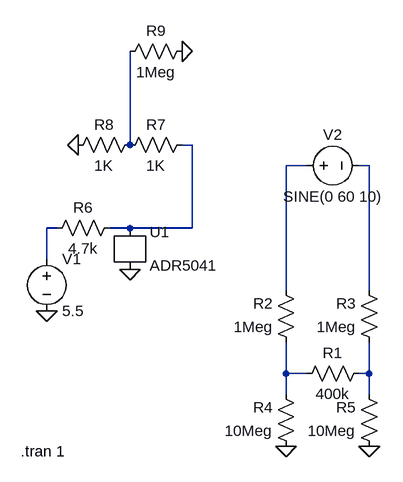
[diagram p0: schematic Isolation experiment.asc]
Isolation experiment.asc, the LTspice schematic file:
Version 4
SHEET 1 880 720
WIRE 192 -16 192 -160
WIRE 288 -16 272 -16
WIRE 464 16 432 16
WIRE 560 16 544 16
WIRE 80 112 64 112
WIRE 192 112 160 112
WIRE 288 112 288 -16
WIRE 288 112 192 112
WIRE 64 160 64 112
WIRE 432 208 432 16
WIRE 560 208 560 16
WIRE 432 336 432 288
WIRE 464 336 432 336
WIRE 560 336 560 288
WIRE 560 336 544 336
WIRE 432 368 432 336
WIRE 560 368 560 336
FLAG 64 240 0
FLAG 432 448 0
FLAG 560 448 0
FLAG 192 176 0
FLAG 112 -16 0
FLAG 272 -160 0
SYMBOL voltage 64 144 R0
WINDOW 123 0 0 Left 0
WINDOW 39 0 0 Left 0
SYMATTR InstName V1
SYMATTR Value 5.5
SYMBOL voltage 448 16 R270
WINDOW 0 32 56 VTop 2
WINDOW 3 -32 56 VBottom 2
WINDOW 123 0 0 Left 0
WINDOW 39 0 0 Left 0
SYMATTR InstName V2
SYMATTR Value SINE(0 60 10)
SYMBOL res 560 320 R90
WINDOW 0 0 56 VBottom 2
WINDOW 3 32 56 VTop 2
SYMATTR InstName R1
SYMATTR Value 400k
SYMBOL res 448 304 R180
WINDOW 0 36 76 Left 2
WINDOW 3 36 40 Left 2
SYMATTR InstName R2
SYMATTR Value 1Meg
SYMBOL res 576 304 R180
WINDOW 0 36 76 Left 2
WINDOW 3 36 40 Left 2
SYMATTR InstName R3
SYMATTR Value 1Meg
SYMBOL res 448 464 R180
WINDOW 0 36 76 Left 2
WINDOW 3 36 40 Left 2
SYMATTR InstName R4
SYMATTR Value 10Meg
SYMBOL res 576 464 R180
WINDOW 0 36 76 Left 2
WINDOW 3 36 40 Left 2
SYMATTR InstName R5
SYMATTR Value 10Meg
SYMBOL References\\ADR5041 192 144 R0
SYMATTR InstName U1
SYMBOL res 176 96 R90
WINDOW 0 0 56 VBottom 2
WINDOW 3 32 56 VTop 2
SYMATTR InstName R6
SYMATTR Value 4.7k
SYMBOL res 288 -32 R90
WINDOW 0 0 56 VBottom 2
WINDOW 3 32 56 VTop 2
SYMATTR InstName R7
SYMATTR Value 1K
SYMBOL res 208 -32 R90
WINDOW 0 0 56 VBottom 2
WINDOW 3 32 56 VTop 2
SYMATTR InstName R8
SYMATTR Value 1K
SYMBOL res 288 -176 R90
WINDOW 0 0 56 VBottom 2
WINDOW 3 32 56 VTop 2
SYMATTR InstName R9
SYMATTR Value 1Meg
TEXT 24 456 Left 2 !.tran 1

The netlist it stands for:
* Isolation experiment.asc
V1 N005 0 5.5
V2 N003 N004 SINE(0 60 10)
R1 N007 N006 400k
R2 N006 N003 1Meg
R3 N007 N004 1Meg
R4 0 N006 10Meg
R5 0 N007 10Meg
XU1 N002 0 ADR5041
R6 N002 N005 4.7k
R7 N002 N001 1K
R8 N001 0 1K
R9 0 N001 1Meg
.tran 1
.lib ADR5041.sub
.backanno
.end